# EAGLE board 56 ch sample-and-hold card v1.2 (EAGLE 9.6.2)
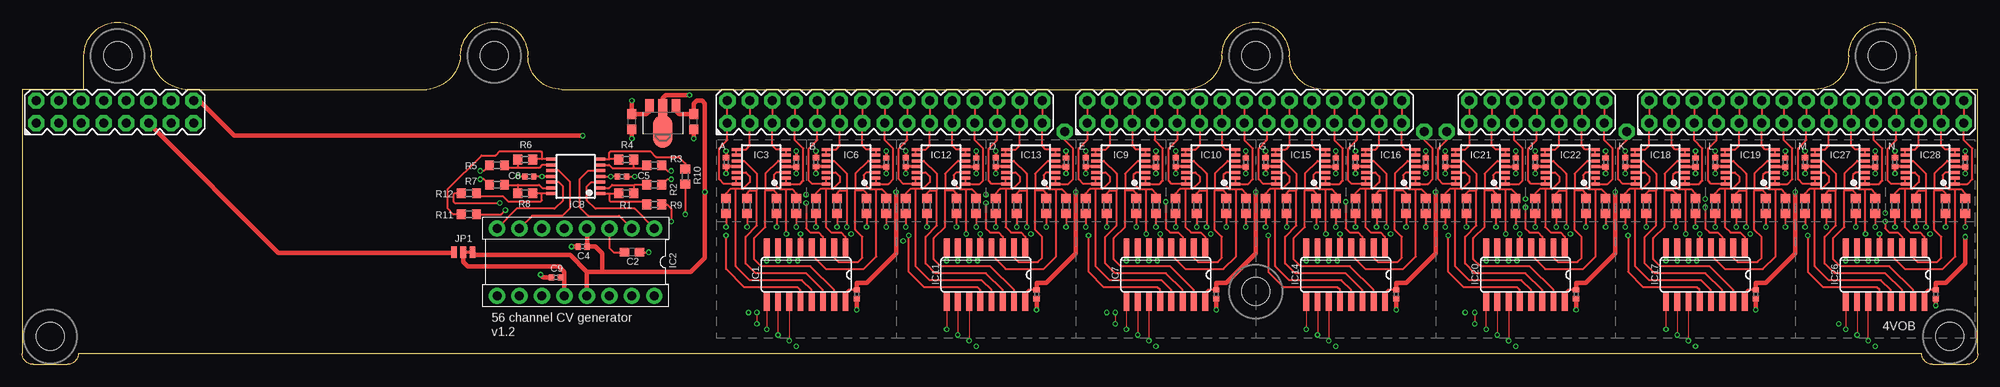
[diagram p3: board, top side]
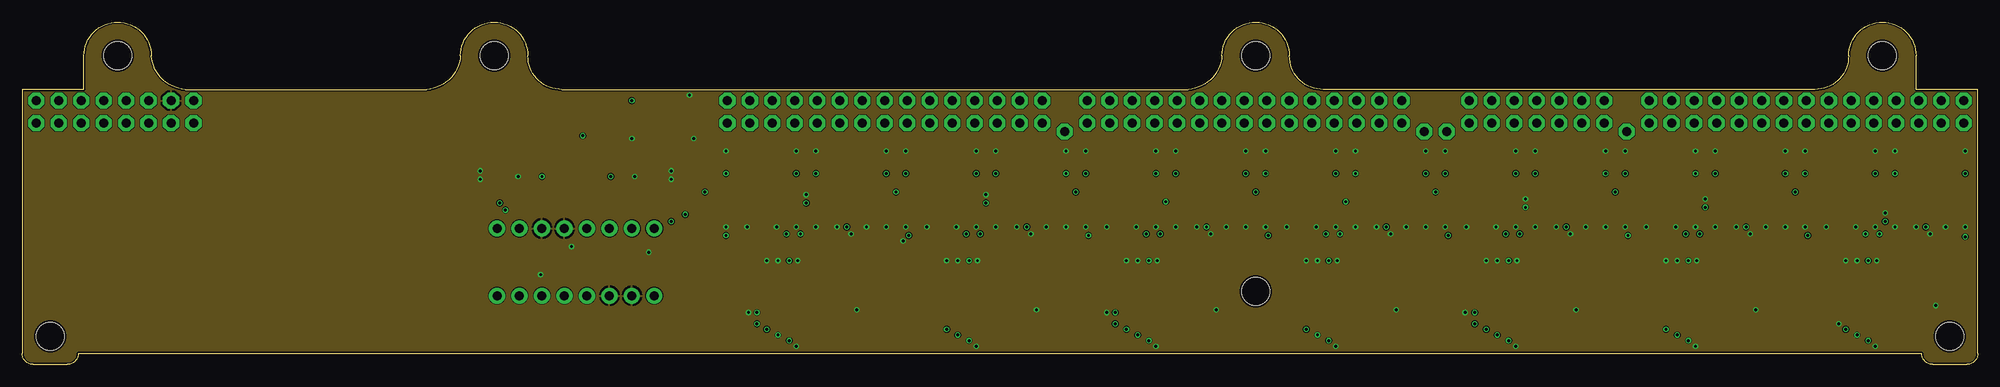
[diagram p4: board, inner layer Route2]
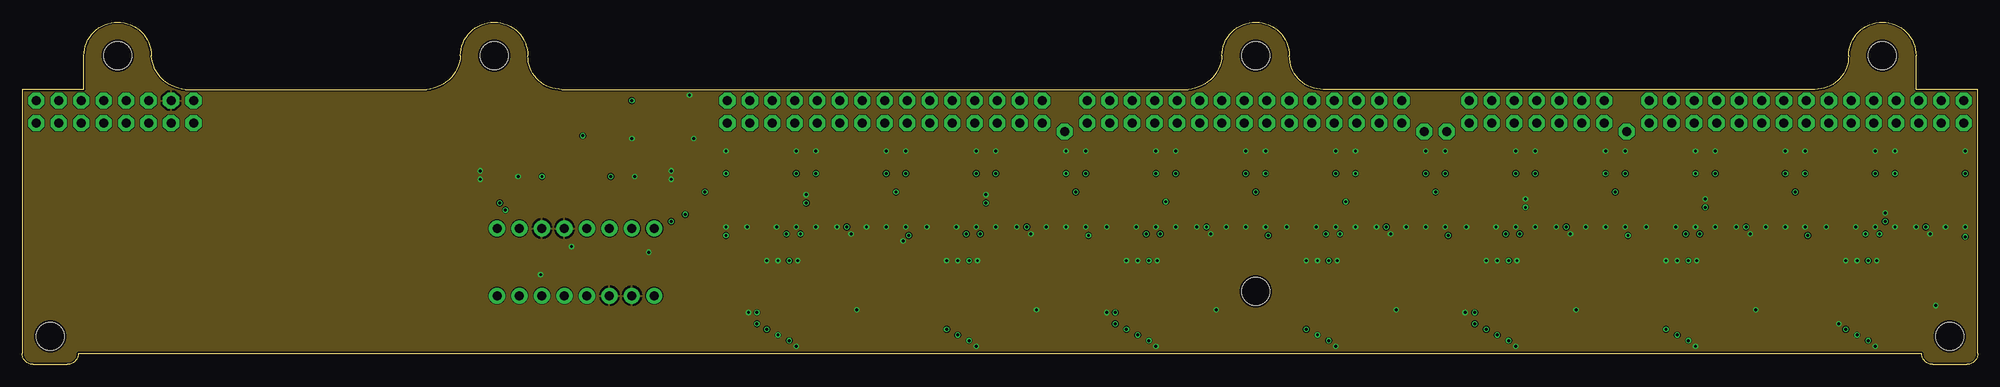
[diagram p5: board, inner layer Route15]
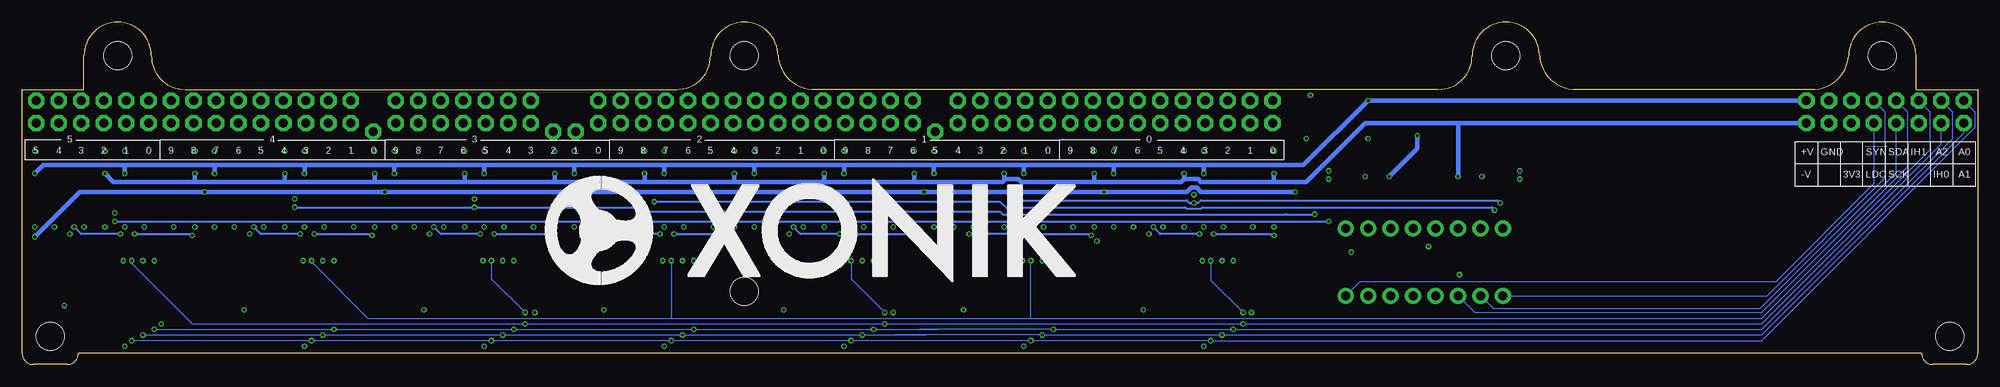
[diagram p6: board, bottom side, seen from below]

Size 220.98 x 38.74 mm. Coordinates in mm from the lower left corner, seen from the top.
Outline: 1.27,0 5.08,0 arc90 6.35,1.27 214.63,1.27 arc90 215.9,0 219.71,0 arc90 220.98,1.27 220.98,31.11 214,31.11 214,34.93 arc180 206.38,34.93 arc-90 202.56,31.11 147,31.11 arc-90 143.19,34.93 arc180 135.57,34.93 arc-81 131.76,31.11 60.96,31.11 arc-90 57.15,34.93 arc180 49.53,34.93 arc-81 45.72,31.11 18.41,31.11 arc-81 14.61,34.93 arc180 6.99,34.93 6.99,31.11 0,31.11 0,1.27 arc90 1.27,0
Copper layers (1+2*15+16): Top 0.035mm / dielectric 0.2mm / Route2 0.0175mm / dielectric 1.065mm / Route15 0.0175mm / dielectric 0.2mm / Bottom 0.035mm
Design rules "jlcpcb-4layers": minimum track width 3.5mil, minimum drill 0.2mm, track to track 3.5mil, track to pad 5mil, pad to pad 5mil, via to via 5mil, smd to smd 5mil, copper to edge 0.2mm, drill to drill 6mil, minimum pad ring 10mil, minimum via ring 0.13mm, stop-mask expansion 0.05mm, vias tented up to drill 16mil, thermal gap 10mil
Holes 3.2 mm at 3.17,3.17 217.81,3.17 139.38,8.26 139.38,34.93 210.19,34.93 10.79,34.93 53.34,34.93

## Footprints (pad centres in the part's own frame; a part is rotated, then mirrored left to right if it is on the bottom)
C0603 = smd 1.1 x 1: 1 -0.85,0; 2 0.85,0
C0402-J = smd 0.6 x 0.7: 1 -0.5,0; 2 0.5,0
C0603-J = smd 1 x 1.1: 1 -0.85,0; 2 0.85,0
SO16 = smd 0.66 x 2.032: 1 -4.445,-3.073; 2 -3.175,-3.073; 3 -1.905,-3.073; 4 -0.635,-3.073; 5 0.635,-3.073; 6 1.905,-3.073; 7 3.175,-3.073; 8 4.445,-3.073; 9 4.445,3.073; 10 3.175,3.073; 11 1.905,3.073; 12 0.635,3.073; 13 -0.635,3.073; 14 -1.905,3.073; 15 -3.175,3.073; 16 -4.445,3.073
DIL16-FM-CON = drill 1.016: 1 -8.89,-3.81; 2 -6.35,-3.81; 3 -3.81,-3.81; 4 -1.27,-3.81; 5 1.27,-3.81; 6 3.81,-3.81; 7 6.35,-3.81; 8 8.89,-3.81; 9 8.89,3.81; 10 6.35,3.81; 11 3.81,3.81; 12 1.27,3.81; 13 -1.27,3.81; 14 -3.81,3.81; 15 -6.35,3.81; 16 -8.89,3.81
TSSOP14J = smd 0.35 x 1: 1 -1.95,-2.825; 2 -1.3,-2.825; 3 -0.65,-2.825; 4 0,-2.825; 5 0.65,-2.825; 6 1.3,-2.825; 7 1.95,-2.825; 8 1.95,2.825; 9 1.3,2.825; 10 0.65,2.825; 11 0,2.825; 12 -0.65,2.825; 13 -1.3,2.825; 14 -1.95,2.825
SOT89 = smd 1 x 1.5: 1 -1.499,-1.981; 3 1.499,-1.981 | smd 1 x 2: 2 0,-1.727 | smd 2.2 x 3.7: 2@1 0,0.94
SMT-JUMPER_3_1-NC_TRACE_NO-SILK = smd 0.66 x 1.27: 1 -1.041,0; 2 0,0; 3 1.041,0
R0603 = smd 1 x 1.1: 1 -0.85,0; 2 0.85,0
MA15-2J = drill 1.016 octagon: 1 -17.78,-1.27; 2 -17.78,1.27; 3 -15.24,-1.27; 4 -15.24,1.27; 5 -12.7,-1.27; 6 -12.7,1.27; 7 -10.16,-1.27; 8 -10.16,1.27; 9 -7.62,-1.27; 10 -7.62,1.27; 11 -5.08,-1.27; 12 -5.08,1.27; 13 -2.54,-1.27; 14 -2.54,1.27; 15 0,-1.27; 16 0,1.27; 17 2.54,-1.27; 18 2.54,1.27; 19 5.08,-1.27; 20 5.08,1.27; 21 7.62,-1.27; 22 7.62,1.27; 23 10.16,-1.27; 24 10.16,1.27; 25 12.7,-1.27; 26 12.7,1.27; 27 15.24,-1.27; 28 15.24,1.27; 29 17.78,-1.27; 30 17.78,1.27
MA01N-1J = drill 1.016 octagon: 1 0,0
MA08-2J = drill 1.016 octagon: 1 -8.89,-1.27; 2 -8.89,1.27; 3 -6.35,-1.27; 4 -6.35,1.27; 5 -3.81,-1.27; 6 -3.81,1.27; 7 -1.27,-1.27; 8 -1.27,1.27; 9 1.27,-1.27; 10 1.27,1.27; 11 3.81,-1.27; 12 3.81,1.27; 13 6.35,-1.27; 14 6.35,1.27; 15 8.89,-1.27; 16 8.89,1.27
MA02N-1J = drill 1.016 octagon: 1 -2.54,0; 2 0,0
MA07-2J = drill 1.016 octagon: 1 -7.62,-1.27; 2 -7.62,1.27; 3 -5.08,-1.27; 4 -5.08,1.27; 5 -2.54,-1.27; 6 -2.54,1.27; 7 0,-1.27; 8 0,1.27; 9 2.54,-1.27; 10 2.54,1.27; 11 5.08,-1.27; 12 5.08,1.27; 13 7.62,-1.27; 14 7.62,1.27

## Placement (x,y rotation side)
C1  0.1uF  [C0603]  75.88,27.46 90 top
C2  100nF  [C0603]  68.9,12.7 180 top
C3  0.33uF  [C0603]  68.9,27.46 90 top
C4  1uF  [C0402-J]  63.34,13.33 180 top
C5  1uF  [C0402-J]  67.79,21.27 0 top
C6  0.1uF  [C0402-J]  94.3,7.94 90 top
C7  1nF  [C0603-J]  87.47,17.94 90 top
C8  1uF  [C0402-J]  57.31,21.27 0 top
C9  1uF  [C0402-J]  60.33,9.84 180 top
C11  1nF  [C0603-J]  85.25,17.94 90 top
C12  1nF  [C0603-J]  81.92,17.94 90 top
C13  1nF  [C0603-J]  79.53,17.94 90 top
C14  1uF  [C0402-J]  87.47,22.86 90 top
C15  1uF  [C0402-J]  79.53,22.88 270 top
C16  1nF  [C0603-J]  97.63,17.94 90 top
C17  1nF  [C0603-J]  95.41,17.94 90 top
C18  1nF  [C0603-J]  92.08,17.94 90 top
C25  1nF  [C0603-J]  89.69,17.94 90 top
C26  1uF  [C0402-J]  97.63,22.86 90 top
C27  1uF  [C0402-J]  89.69,22.88 270 top
C28  0.1uF  [C0402-J]  134.94,7.94 90 top
C29  1nF  [C0603-J]  128.11,17.94 90 top
C30  1nF  [C0603-J]  125.89,17.94 90 top
C31  1nF  [C0603-J]  122.56,17.94 90 top
C32  1nF  [C0603-J]  120.17,17.94 90 top
C33  1uF  [C0402-J]  128.11,22.86 90 top
C34  1uF  [C0402-J]  120.17,22.88 270 top
C35  1nF  [C0603-J]  138.27,17.94 90 top
C36  1nF  [C0603-J]  136.05,17.94 90 top
C37  1nF  [C0603-J]  132.72,17.94 90 top
C38  1nF  [C0603-J]  130.33,17.94 90 top
C39  1uF  [C0402-J]  138.27,22.86 90 top
C41  1uF  [C0402-J]  130.33,22.88 270 top
C42  0.1uF  [C0402-J]  114.62,7.94 90 top
C43  1nF  [C0603-J]  107.79,17.94 90 top
C44  1nF  [C0603-J]  105.57,17.94 90 top
C45  1nF  [C0603-J]  102.23,17.94 90 top
C46  1nF  [C0603-J]  99.85,17.94 90 top
C47  1uF  [C0402-J]  107.79,22.86 90 top
C48  1uF  [C0402-J]  99.85,22.88 270 top
C49  1nF  [C0603-J]  117.95,17.94 90 top
C50  1nF  [C0603-J]  115.73,17.94 90 top
C51  1nF  [C0603-J]  112.39,17.94 90 top
C52  1nF  [C0603-J]  110.01,17.94 90 top
C53  1uF  [C0402-J]  117.95,22.86 90 top
C54  1uF  [C0402-J]  110.01,22.88 270 top
C55  0.1uF  [C0402-J]  155.26,7.94 90 top
C56  1nF  [C0603-J]  148.43,17.94 90 top
C57  1nF  [C0603-J]  146.21,17.94 90 top
C58  1nF  [C0603-J]  142.88,17.94 90 top
C59  1nF  [C0603-J]  140.49,17.94 90 top
C60  1uF  [C0402-J]  148.43,22.86 90 top
C61  1uF  [C0402-J]  140.49,22.88 270 top
C62  1nF  [C0603-J]  158.59,17.94 90 top
C63  1nF  [C0603-J]  156.37,17.94 90 top
C64  1nF  [C0603-J]  153.03,17.94 90 top
C65  1nF  [C0603-J]  150.65,17.94 90 top
C66  1uF  [C0402-J]  158.59,22.86 90 top
C67  1uF  [C0402-J]  150.65,22.88 270 top
C68  0.1uF  [C0402-J]  195.9,7.94 90 top
C69  1nF  [C0603-J]  189.07,17.94 90 top
C70  1nF  [C0603-J]  186.85,17.94 90 top
C71  1nF  [C0603-J]  183.51,17.94 90 top
C72  1nF  [C0603-J]  181.13,17.94 90 top
C73  1uF  [C0402-J]  189.07,22.86 90 top
C74  1uF  [C0402-J]  181.13,22.88 270 top
C75  1nF  [C0603-J]  199.23,17.94 90 top
C76  1nF  [C0603-J]  197.01,17.94 90 top
C77  1nF  [C0603-J]  193.68,17.94 90 top
C78  1nF  [C0603-J]  191.29,17.94 90 top
C79  1uF  [C0402-J]  199.23,22.86 90 top
C80  1uF  [C0402-J]  191.29,22.88 270 top
C81  0.1uF  [C0402-J]  175.58,7.94 90 top
C82  1nF  [C0603-J]  168.75,17.94 90 top
C83  1nF  [C0603-J]  166.53,17.94 90 top
C84  1nF  [C0603-J]  163.19,17.94 90 top
C85  1nF  [C0603-J]  160.81,17.94 90 top
C86  1uF  [C0402-J]  168.75,22.86 90 top
C87  1uF  [C0402-J]  160.81,22.88 270 top
C88  1nF  [C0603-J]  178.91,17.94 90 top
C89  1nF  [C0603-J]  176.69,17.94 90 top
C90  1nF  [C0603-J]  173.35,17.94 90 top
C91  1nF  [C0603-J]  170.97,17.94 90 top
C92  1uF  [C0402-J]  178.91,22.86 90 top
C93  1uF  [C0402-J]  170.97,22.88 270 top
C107  0.1uF  [C0402-J]  216.22,7.94 90 top
C108  1nF  [C0603-J]  209.39,17.94 90 top
C109  1nF  [C0603-J]  207.17,17.94 90 top
C110  1nF  [C0603-J]  203.84,17.94 90 top
C111  1nF  [C0603-J]  201.45,17.94 90 top
C112  1uF  [C0402-J]  209.39,22.86 90 top
C113  1uF  [C0402-J]  201.45,22.88 270 top
C114  1nF  [C0603-J]  219.55,17.94 90 top
C115  1nF  [C0603-J]  217.33,17.94 90 top
C116  1nF  [C0603-J]  214,17.94 90 top
C117  1nF  [C0603-J]  211.61,17.94 90 top
C118  1uF  [C0402-J]  219.55,22.86 90 top
C119  1uF  [C0402-J]  211.61,22.88 270 top
IC1  74HCT4051D  [SO16]  88.58,10.16 180 top
IC2  DAC8565F  [DIL16-FM-CON]  62.55,11.59 180 top
IC3  TL074JT  [TSSOP14J]  83.5,22.38 90 top
IC5  78L05F  [SOT89]  72.39,27.3 180 top
IC6  TL074JT  [TSSOP14J]  93.66,22.38 90 top
IC7  74HCT4051D  [SO16]  129.22,10.16 180 top
IC8  TL074JT  [TSSOP14J]  62.55,21.27 90 top
IC9  TL074JT  [TSSOP14J]  124.14,22.38 90 top
IC10  TL074JT  [TSSOP14J]  134.3,22.38 90 top
IC11  74HCT4051D  [SO16]  108.9,10.16 180 top
IC12  TL074JT  [TSSOP14J]  103.82,22.38 90 top
IC13  TL074JT  [TSSOP14J]  113.98,22.38 90 top
IC14  74HCT4051D  [SO16]  149.54,10.16 180 top
IC15  TL074JT  [TSSOP14J]  144.46,22.38 90 top
IC16  TL074JT  [TSSOP14J]  154.62,22.38 90 top
IC17  74HCT4051D  [SO16]  190.18,10.16 180 top
IC18  TL074JT  [TSSOP14J]  185.1,22.38 90 top
IC19  TL074JT  [TSSOP14J]  195.26,22.38 90 top
IC20  74HCT4051D  [SO16]  169.86,10.16 180 top
IC21  TL074JT  [TSSOP14J]  164.78,22.38 90 top
IC22  TL074JT  [TSSOP14J]  174.94,22.38 90 top
IC26  74HCT4051D  [SO16]  210.5,10.16 180 top
IC27  TL074JT  [TSSOP14J]  205.42,22.38 90 top
IC28  TL074JT  [TSSOP14J]  215.58,22.38 90 top
JP1  JUMPER-SMT_3_1-NC_TRACE_NO-SILK_DNM  [SMT-JUMPER_3_1-NC_TRACE_NO-SILK]  49.85,12.7 0 top
R1  10k  [R0603]  68.26,19.37 180 top
R2  10k  [R0603]  71.44,20.32 180 top
R3  10k  [R0603]  71.44,22.54 180 top
R4  10k  [R0603]  68.26,23.18 180 top
R5  10k  [R0603]  53.66,22.54 0 top
R6  10k  [R0603]  56.83,23.18 0 top
R7  10k  [R0603]  53.66,20.32 0 top
R8  10k  [R0603]  56.83,19.37 0 top
R9  220R  [R0603]  71.44,18.1 0 top
R10  220R  [R0603]  74.93,21.27 270 top
R11  220R  [R0603]  50.48,16.99 0 top
R12  220R  [R0603]  50.48,19.37 180 top
U$1  [XONIK_LOGO_60]  161.93,9.05 0 bottom
U$2  MA15-2J-FEMALE  [MA15-2J]  97.47,28.57 0 top
U$3  MA15-2J-FEMALE  [MA15-2J]  138.11,28.57 0 top
U$4  MA15-2J-FEMALE  [MA15-2J]  201.61,28.57 0 top
X4  DNM  [MA01N-1J]  181.29,26.35 0 top
X5  DNM  [MA01N-1J]  117.79,26.35 0 top
X6  MA08-2J-FEMALE  [MA08-2J]  10.48,28.57 0 top
X9  DNM  [MA02N-1J]  160.97,26.35 0 top
X10  MA07-2J-FEMALE  [MA07-2J]  171.13,28.57 0 top

## Tracks (layer width: path | path; a pad name or v marks a point on that pad's centre or on a via)
5V_REF
  Top 0.254: IC2.3 66.36,13.18 66.83,12.7 C2.2
!SYNC
  Bottom 0.127: 10.56,21.03 10.48,21.11 10.48,24.13
  Bottom 0.13: IC2.9 23.81,7.78 10.56,21.03 | 10.48,24.13 10.48,28.57 X6.10
+3V3
  Top 0.508: JP1.1 48.72,12.61 28.96,12.61 14.29,27.29 X6.11
+5V  (via drill 0.33)
  Top 0.254: C6.2 94.27,8.41 93.34,8.41 93.03,8.1 IC1.16 | C42.2 114.59,8.41 113.67,8.41 113.35,8.1 IC11.16 | C28.2 134.91,8.41 133.99,8.41 133.67,8.1 IC7.16 | C55.2 155.23,8.41 154.31,8.41 153.99,8.1 IC14.16 | C81.2 175.55,8.41 174.62,8.41 174.31,8.1 IC20.16 | C68.2 195.87,8.41 194.94,8.41 194.63,8.1 IC17.16 | C107.2 216.19,8.41 215.26,8.41 214.95,8.1 IC26.16
  Top 0.508: C6.2 94.3,9.21 95.41,9.21 98.74,12.54 v98.74,19.53 | C42.2 114.62,9.21 115.73,9.21 119.06,12.54 v119.06,19.53 | C28.2 134.94,9.21 136.05,9.21 139.38,12.54 v139.38,19.53 | C55.2 155.26,9.21 156.37,9.21 159.7,12.54 v159.7,19.53 | C81.2 175.58,9.21 176.69,9.21 180.02,12.54 v180.02,19.53 | C68.2 195.9,9.21 197.01,9.21 200.34,12.54 v200.34,19.53 | C107.2 216.22,9.21 217.33,9.21 219.55,11.43 v219.55,14.45 | IC5.1 73.89,28.66 74.24,28.31 C1.2 75.88,29.53 76.2,29.84 76.83,29.84 77.15,29.53 v77.15,19.53 77.15,12.06 75.56,10.48 65.56,10.48 | IC2.4 63.84,15.38 C4.1 64.77,13.33 65.56,12.54 65.56,10.48 | 65.56,10.48 63.82,10.48 | 63.82,10.48 61.91,12.38 51.21,12.38 JP1.3 | IC2.13 63.82,10.48
  Bottom 0.508: v219.55,14.45 214.47,19.53 v200.34,19.53 v180.02,19.53 v159.7,19.53 v139.38,19.53 v119.06,19.53 109.7,19.53 109.22,20 108.58,20 108.11,19.53 v98.74,19.53 89.38,19.53 88.9,20 88.27,20 87.79,19.53 v77.15,19.53
+12V  (via drill 0.33)
  Top 0.254: C5.1 v66.52,21.27 IC8.4
  Top 0.356: IC3.4 87.45,22.38 C14.1 v87.47,21.59 | IC6.4 97.61,22.38 C26.1 v97.63,21.59 | IC12.4 107.77,22.38 C47.1 v107.79,21.59 | IC13.4 117.93,22.38 C53.1 v117.95,21.59 | IC9.4 128.09,22.38 C33.1 v128.11,21.59 | IC10.4 138.25,22.38 C39.1 v138.27,21.59 | IC15.4 148.41,22.38 C60.1 v148.43,21.59 | IC16.4 158.57,22.38 C66.1 v158.59,21.59 | IC21.4 168.73,22.38 C86.1 v168.75,21.59 | IC22.4 178.89,22.38 C92.1 v178.91,21.59 | IC18.4 189.05,22.38 C73.1 v189.07,21.59 | IC19.4 199.21,22.38 C79.1 v199.23,21.59 | IC27.4 209.37,22.38 C112.1 v209.39,21.59 | IC28.4 219.53,22.38 C118.1 v219.55,21.59
  Top 0.508: IC5.3 70.89,28.66 70.54,28.31 C3.2 v68.9,29.84 | X6.16 20,29.84 23.97,25.88 v63.34,25.88
  Bottom 0.508: 97.63,21.75 v97.63,21.59 97.63,22.54 | 87.47,21.75 v87.47,21.59 87.47,22.54 | 117.95,21.75 v117.95,21.59 117.95,22.38 118.11,22.54 | 107.79,21.75 v107.79,21.59 107.79,22.54 | 138.27,21.75 v138.27,21.59 138.27,22.54 | 128.11,21.75 v128.11,21.59 128.11,22.38 128.27,22.54 | 158.59,21.75 v158.59,21.59 158.59,22.54 | 148.43,21.75 v148.43,21.59 148.43,22.54 | 178.91,21.75 v178.91,21.59 178.91,22.54 | 168.75,21.75 v168.75,21.59 168.75,22.54 | 199.23,21.75 v199.23,21.59 199.23,22.54 | 189.07,21.75 v189.07,21.59 189.07,22.38 189.23,22.54 | 209.39,21.75 v209.39,21.59 209.39,22.54 | X6.16 v68.9,29.84 76.2,22.54 87.47,22.54 | v219.55,21.59 218.6,22.54 209.39,22.54 | 97.63,22.54 107.79,22.54 | 107.79,22.54 118.11,22.54 | 118.11,22.54 128.27,22.54 | 128.27,22.54 138.27,22.54 | 138.27,22.54 148.43,22.54 | 148.43,22.54 158.59,22.54 | 158.59,22.54 168.75,22.54 | 168.75,22.54 178.91,22.54 | 178.91,22.54 189.23,22.54 | 189.23,22.54 199.23,22.54 | 199.23,22.54 209.39,22.54 | 97.63,22.54 87.47,22.54 | v63.34,25.88 63.34,24.45 v66.52,21.27
-12V  (via drill 0.33)
  Top 0.254: C8.2 v58.74,21.27 IC8.11
  Top 0.356: IC3.11 C15.2 v79.53,21.59 | IC6.11 C27.2 v89.69,21.59 | IC12.11 C48.2 v99.85,21.59 | IC13.11 C54.2 v110.01,21.59 | IC9.11 C34.2 v120.17,21.59 | IC10.11 C41.2 v130.33,21.59 | IC15.11 C61.2 v140.49,21.59 | IC16.11 C67.2 v150.65,21.59 | IC21.11 C87.2 v160.81,21.59 | IC22.11 C93.2 v170.97,21.59 | IC18.11 C74.2 v181.13,21.59 | IC19.11 C80.2 v191.29,21.59 | IC27.11 C113.2 v201.45,21.59 | IC28.11 C119.2 v211.61,21.59
  Bottom 0.508: v79.53,21.59 79.53,20.64 | v89.69,21.59 89.69,20.95 | 79.53,20.64 75.88,20.64 69.22,27.3 X6.15 58.74,27.3 v58.74,21.27 | v99.85,21.59 99.85,20.64 | v110.01,21.59 110.01,20.95 | 110.01,20.95 110.01,20.8 110.17,20.64 120.17,20.64 | 99.85,20.64 90.01,20.64 89.69,20.95 | v120.17,21.59 120.17,20.64 | v130.33,21.59 130.33,20.64 | v140.49,21.59 140.49,20.64 | v150.65,21.59 150.65,20.64 | 130.33,20.64 140.49,20.64 | v160.81,21.59 160.81,20.64 | v170.97,21.59 170.97,20.64 | 150.65,20.64 160.81,20.64 | v181.13,21.59 181.13,20.64 | v191.29,21.59 191.29,20.64 | 170.97,20.64 181.13,20.64 | v201.45,21.59 201.45,20.64 | v211.61,21.59 210.66,20.64 201.45,20.64 | 191.29,20.64 201.45,20.64 | 181.13,20.64 191.29,20.64 | 160.81,20.64 170.97,20.64 | 140.49,20.64 150.65,20.64 | 120.17,20.64 130.33,20.64 | 99.85,20.64 108.11,20.64 108.43,20.95 110.01,20.95 | 79.53,20.64 87.79,20.64 88.11,20.95 89.69,20.95
A0  (via drill 0.33)
  Top 0.13: IC1.11 v86.68,2.7 | v208.6,2.7 IC26.11 | IC17.11 v188.28,2.7 | IC14.11 v147.64,2.7 | IC7.11 v127.32,2.7 | IC11.11 v107,2.7 | IC20.11 v167.96,2.7
  Bottom 0.127: 0.4,26.75 0.32,26.83 0.32,28.57 X6.2 | 118.9,2.7 121.13,2.7
  Bottom 0.13: 118.9,2.7 v107,2.7 v86.68,2.7 24.45,2.7 0.4,26.75 | 121.13,2.7 v127.32,2.7 v147.64,2.7 v167.96,2.7 v188.28,2.7 v208.6,2.7
A1  (via drill 0.33)
  Top 0.13: IC26.10 v207.33,3.33 | v85.41,3.33 IC1.10 | IC17.10 v187.01,3.33 | IC14.10 v146.37,3.33 | IC7.10 v126.05,3.33 | IC11.10 v105.73,3.33 | IC20.10 v166.69,3.33
  Bottom 0.127: 118.59,3.33 122.4,3.33
  Bottom 0.13: v207.33,3.33 v187.01,3.33 v166.69,3.33 v146.37,3.33 v126.05,3.33 122.4,3.33 118.9,3.33 | 118.59,3.33 v105.73,3.33 v85.41,3.33 24.45,3.33 1.59,26.19 X6.1
A2  (via drill 0.33)
  Top 0.13: IC1.9 v84.14,3.97 | IC26.9 v206.06,3.97 | IC17.9 v185.74,3.97 | IC14.9 v145.1,3.97 | IC7.9 v124.78,3.97 | IC11.9 v104.46,3.97 | v165.42,3.97 IC20.9
  Bottom 0.127: v124.78,3.97 119.54,3.97 116.68,3.97
  Bottom 0.13: v206.06,3.97 v185.74,3.97 v165.42,3.97 v145.1,3.97 119.54,3.97 117.47,3.97 | 116.68,3.97 v104.46,3.97 v84.14,3.97 24.45,3.97 2.86,25.56 2.86,28.57 X6.4
AGND  (via drill 0.33)
  Top 0.254: C13.1 v79.53,15.56 | C12.1 v81.92,15.56 | C11.1 v85.25,15.56 | C7.1 v87.47,15.56 | C25.1 v89.69,15.56 | C18.1 v92.08,15.56 | C17.1 v95.41,15.56 | C16.1 v97.63,15.56 | IC1.8 v84.14,11.75 | IC1.7 v85.41,11.75 | C46.1 v99.85,15.56 | C45.1 v102.23,15.56 | C44.1 v105.57,15.56 | C43.1 v107.79,15.56 | C52.1 v110.01,15.56 | C51.1 v112.39,15.56 | C50.1 v115.73,15.56 | C49.1 v117.95,15.56 | IC11.8 v104.46,11.75 | IC11.7 v105.73,11.75 | C32.1 v120.17,15.56 | C31.1 v122.56,15.56 | C30.1 v125.89,15.56 | C29.1 v128.11,15.56 | C38.1 v130.33,15.56 | C37.1 v132.72,15.56 | C36.1 v136.05,15.56 | C35.1 v138.27,15.56 | IC7.8 v124.78,11.75 | IC7.7 v126.05,11.75 | C59.1 v140.49,15.56 | C58.1 v142.88,15.56 | C57.1 v146.21,15.56 | C56.1 v148.43,15.56 | C65.1 v150.65,15.56 | C64.1 v153.03,15.56 | C63.1 v156.37,15.56 | C62.1 v158.59,15.56 | IC14.8 v145.1,11.75 | IC14.7 v146.37,11.75 | C85.1 v160.81,15.56 | C84.1 v163.19,15.56 | C83.1 v166.53,15.56 | C82.1 v168.75,15.56 | C91.1 v170.97,15.56 | C90.1 v173.35,15.56 | C89.1 v176.69,15.56 | C88.1 v178.91,15.56 | IC20.8 v165.42,11.75 | IC20.7 v166.69,11.75 | C72.1 v181.13,15.56 | C71.1 v183.51,15.56 | C70.1 v186.85,15.56 | C69.1 v189.07,15.56 | C78.1 v191.29,15.56 | C77.1 v193.68,15.56 | C76.1 v197.01,15.56 | C75.1 v199.23,15.56 | IC17.8 v185.74,11.75 | IC17.7 v187.01,11.75 | C111.1 v201.45,15.56 | C110.1 v203.84,15.56 | C109.1 v207.17,15.56 | C108.1 v209.39,15.56 | C117.1 v211.61,15.56 | C116.1 v214,15.56 | C115.1 v217.33,15.56 | C114.1 v219.55,15.56 | IC26.8 v206.06,11.75 | IC26.7 v207.33,11.75 | C2.1 v70.8,12.7 | R5.1 52.17,21.91 v51.75,21.91 | R7.1 52.17,20.95 v51.75,20.95 | R3.1 72.92,21.91 v73.34,21.91 | R2.1 72.92,20.95 v73.34,20.95 | C5.2 v69.22,21.27 | C8.1 v56.04,21.27 | IC5.2 IC5.2@1
  Top 0.356: v79.53,24.13 C15.1 | v87.47,24.13 C14.2 | v89.69,24.13 C27.1 | v97.63,24.13 C26.2 | v99.85,24.13 C48.1 | v107.79,24.13 C47.2 | v110.01,24.13 C54.1 | v117.95,24.13 C53.2 | v120.17,24.13 C34.1 | v128.11,24.13 C33.2 | v130.33,24.13 C41.1 | v138.27,24.13 C39.2 | v140.49,24.13 C61.1 | v148.43,24.13 C60.2 | v150.65,24.13 C67.1 | v158.59,24.13 C66.2 | v160.81,24.13 C87.1 | v168.75,24.13 C86.2 | v170.97,24.13 C93.1 | v178.91,24.13 C92.2 | v181.13,24.13 C74.1 | v189.07,24.13 C73.2 | v191.29,24.13 C80.1 | v199.23,24.13 C79.2 | v201.45,24.13 C113.1 | v209.39,24.13 C112.2 | v211.61,24.13 C119.1 | v219.55,24.13 C118.2
  Top 0.508: C6.1 v94.3,6.19 | C42.1 v114.62,6.19 | C28.1 v134.94,6.19 | C55.1 v155.26,6.19 | C81.1 v175.58,6.19 | C68.1 v195.9,6.19 | C107.1 v216.22,6.67 | C3.1 v68.9,25.56 | C1.1 v75.88,25.56 | IC5.2 72.39,30.14 72.73,30.48 v75.41,30.48 | C4.2 v62.07,13.33 | C9.2 58.9,9.84 v58.58,10.16
  other vias: 82.07,5.87 87.47,2.06 107.79,2.06 128.11,2.06 148.43,2.06 168.75,2.06 189.07,2.06 209.39,2.06 169.86,18.73 190.18,18.73 210.5,17.14 108.9,19.21 88.58,19.21 93.66,14.76 113.98,14.76 134.3,14.76 154.62,14.76 174.94,14.76 195.26,14.76 215.58,14.76 99.54,13.97 87.63,11.75 107.95,11.75 128.27,11.75 148.59,11.75 168.91,11.75 189.23,11.75 209.55,11.75 122.56,5.87 163.04,5.87 205.26,4.6
  pour Route2: -1.11,41.28 222.25,41.28 222.25,0 -1.11,0
  pour Route15: -1.91,42.55 223.52,42.55 223.52,-0.64 -1.91,-0.64
DAC_1  (via drill 0.33)
  Top 0.254: v210.5,16.19 210.5,15.4 210.98,14.92 211.93,14.92 212.41,14.45 IC26.3 | R9.2 72.87,18.1 73.34,17.62 v73.34,16.19
  Bottom 0.254: v210.5,16.19 v73.34,16.19
DAC_2  (via drill 0.33)
  Top 0.254: v169.86,17.78 169.86,15.4 170.34,14.92 171.29,14.92 171.77,14.45 IC20.3 | v190.18,17.78 190.18,15.4 190.66,14.92 191.61,14.92 192.09,14.45 IC17.3 | R10.2 74.93,17.04 74.96,17.01 v74.93,16.99
  Bottom 0.254: v190.18,17.78 v169.86,17.78 150.65,17.78 150.18,17.3 110.49,17.3 110.17,16.99 78.26,16.99 78.11,16.99 v74.93,16.99
DAC_3  (via drill 0.33)
  Top 0.254: v129.22,18.41 129.22,15.4 129.7,14.92 130.65,14.92 131.13,14.45 IC7.3 | v149.54,18.41 149.54,15.4 150.02,14.92 150.97,14.92 151.45,14.45 IC14.3 | R11.2 54.13,16.99 v54.61,17.46
  Bottom 0.254: v149.54,18.41 v129.22,18.41 110.49,18.41 109.7,17.62 108.11,17.62 107.95,17.78 89.53,17.78 89.38,17.62 87.79,17.62 87.63,17.78 54.93,17.78 v54.61,17.46
DAC_4  (via drill 0.33)
  Top 0.254: v88.58,18.26 88.58,15.4 89.06,14.92 90.01,14.92 90.49,14.45 IC1.3 | v108.9,18.26 108.9,15.4 109.38,14.92 110.33,14.92 110.81,14.45 IC11.3 | R12.2 48.9,19.37 48.74,19.21 48.74,18.41 48.9,18.26 v53.98,18.26
  Bottom 0.254: v108.9,18.26 108.43,18.26 108.11,18.57 89.38,18.57 89.06,18.26 v88.58,18.26 88.11,18.26 87.79,18.57 54.29,18.57 v53.98,18.26
DAC_BUF_1
  Top 0.254: IC8.1 66.36,19.32 | 66.36,19.32 67.37,19.32 R1.2 | 66.36,19.32 66.36,18.57 66.52,18.41 70.27,18.41 R9.1
DAC_BUF_2
  Top 0.254: IC8.7 66.36,23.22 | 66.36,23.22 67.37,23.22 R4.2 | 66.36,23.22 66.36,23.97 66.52,24.13 70.96,24.13 71.6,23.5 74.19,23.5 74.93,22.76 R10.1
DAC_BUF_3
  Top 0.254: IC8.8 58.74,23.22 | 58.74,23.22 57.73,23.22 R6.2 | 58.74,23.22 58.74,23.97 58.58,24.13 53.98,24.13 53.5,23.65 51.91,23.65 48.1,19.84 48.1,17.62 48.74,16.99 R11.1
DAC_BUF_4
  Top 0.254: IC8.14 58.74,19.32 | 58.74,19.32 57.73,19.32 R8.2 | R12.1 51.65,19.05 54.29,19.05 54.93,18.41 58.58,18.41 58.74,18.57 58.74,19.32
DAC_RAW_1
  Top 0.254: IC8.3 64.28,20.62 63.82,20.16 63.82,18.57 64.77,17.62 69.22,17.62 IC2.1
DAC_RAW_2
  Top 0.254: IC8.5 63.99,21.92 63.02,20.95 63.02,17.78 63.98,16.83 67.47,16.83 IC2.2
DAC_RAW_3
  Top 0.254: IC8.10 60.63,21.92 61.91,20.64 61.91,17.72 61.02,16.83 57.63,16.83 IC2.7
DAC_RAW_4
  Top 0.254: IC8.12 59.74,20.64 60.64,20.64 61.12,20.16 61.12,18.57 60.17,17.62 55.88,17.62 IC2.8
IN_0
  Top 0.254: IC3.12 81.77,21.73 82.23,21.27 82.23,20.64 81.44,19.84 80.64,19.84 | C13.2 79.53,19.37 80.01,19.84 80.64,19.84 | IC1.13 89.22,8.41 88.11,9.53 82.23,9.53 80.64,11.11 80.64,19.84
IN_1
  Top 0.254: IC3.10 81.58,23.03 83.03,21.59 83.03,19.68 | 83.03,19.68 83.03,15.72 81.76,14.45 81.76,11.43 82.87,10.32 88.58,10.32 90.49,8.41 IC1.14 | C12.2 81.92,19.37 82.23,19.68 83.03,19.68
IN_2
  Top 0.254: IC3.5 85.42,23.03 83.98,21.59 83.98,19.84 83.98,19.74 83.98,19.68 | 83.98,19.68 83.98,15.56 82.71,14.29 82.71,11.91 83.5,11.11 89.06,11.11 91.76,8.41 IC1.15 | C11.2 85.25,19.37 84.93,19.68 83.98,19.68
IN_3  (via drill 0.33)
  Top 0.254: C7.2 87.47,19.37 87,19.84 86.36,19.84 | IC3.3 85.23,21.73 84.93,21.43 84.93,20.48 85.57,19.84 86.36,19.84 | v86.36,14.76 86.36,19.84 | IC1.12 87.95,8.41 87.63,8.73 81.6,8.73 79.53,10.79 v79.53,14.61
  Bottom 0.254: v86.36,14.76 79.69,14.76 v79.53,14.61
IN_4
  Top 0.254: IC6.12 91.93,21.73 92.39,21.27 92.39,20.64 91.6,19.84 90.81,19.84 | C25.2 89.69,19.37 90.17,19.84 90.81,19.84 | 90.81,19.84 90.81,15.56 91.44,14.92 92.55,14.92 93.03,14.45 IC1.1
IN_5  (via drill 0.33)
  Top 0.254: IC6.10 91.74,23.03 93.19,21.59 93.19,19.68 | C18.2 92.08,19.37 92.39,19.68 93.19,19.68 | v87.95,14.76 IC1.5 | 93.19,19.68 v93.19,15.56
  Bottom 0.254: v93.19,15.56 92.39,14.76 v87.95,14.76
IN_6
  Top 0.254: IC6.5 95.58,23.03 94.14,21.59 94.14,19.84 94.14,19.74 94.14,19.68 | 94.14,19.68 94.14,15.24 94.93,14.45 94.93,12.06 94.46,11.59 92.23,11.59 91.76,12.06 IC1.2 | C17.2 95.41,19.37 95.09,19.68 94.14,19.68
IN_7
  Top 0.254: C16.2 97.63,19.37 97.16,19.84 96.52,19.84 | IC6.3 95.39,21.73 95.09,21.43 95.09,20.48 95.73,19.84 96.52,19.84 | IC1.4 89.22,12.38 90.81,10.79 95.09,10.79 96.52,12.22 96.52,19.84
IN_8
  Top 0.254: IC12.12 102.09,21.73 102.55,21.27 102.55,20.64 101.76,19.84 100.97,19.84 | C46.2 99.85,19.37 100.33,19.84 100.97,19.84 | IC11.13 109.54,8.41 108.43,9.53 102.55,9.53 100.97,11.11 100.97,19.84
IN_9
  Top 0.254: IC12.10 101.9,23.03 103.35,21.59 103.35,19.68 | 103.35,19.68 103.35,15.72 102.08,14.45 102.08,11.43 103.19,10.32 108.9,10.32 110.81,8.41 IC11.14 | C45.2 102.23,19.37 102.55,19.68 103.35,19.68
IN_10
  Top 0.254: IC12.5 105.74,23.03 104.3,21.59 104.3,19.84 104.3,19.74 104.3,19.68 | 104.3,19.68 104.3,15.56 103.03,14.29 103.03,11.91 103.82,11.11 109.38,11.11 112.08,8.41 IC11.15 | C44.2 105.57,19.37 105.25,19.68 104.3,19.68
IN_11  (via drill 0.33)
  Top 0.254: C43.2 107.79,19.37 107.31,19.84 106.68,19.84 | IC12.3 105.55,21.73 105.25,21.43 105.25,20.48 105.89,19.84 106.68,19.84 | v106.68,14.76 106.68,19.84 | IC11.12 108.27,8.41 107.95,8.73 101.92,8.73 100.17,10.48 v100.17,14.61
  Bottom 0.254: v106.68,14.76 100.33,14.76 v100.17,14.61
IN_12
  Top 0.254: IC13.12 112.25,21.73 112.71,21.27 112.71,20.64 111.92,19.84 111.12,19.84 | C52.2 110.01,19.37 110.49,19.84 111.12,19.84 | 111.12,19.84 111.12,15.56 111.76,14.92 112.87,14.92 113.35,14.45 IC11.1
IN_13  (via drill 0.33)
  Top 0.254: IC13.10 112.06,23.03 113.51,21.59 113.51,19.68 | C51.2 112.39,19.37 112.71,19.68 113.51,19.68 | v108.27,14.76 IC11.5 | 113.51,19.68 v113.51,15.56
  Bottom 0.254: v113.51,15.56 112.71,14.76 v108.27,14.76
IN_14
  Top 0.254: IC13.5 115.9,23.03 114.46,21.59 114.46,19.84 114.46,19.74 114.46,19.68 | 114.46,19.68 114.46,15.24 115.25,14.45 115.25,12.06 114.78,11.59 112.55,11.59 112.08,12.06 IC11.2 | C50.2 115.73,19.37 115.41,19.68 114.46,19.68
IN_15
  Top 0.254: C49.2 117.95,19.37 117.47,19.84 116.84,19.84 | IC13.3 115.71,21.73 115.41,21.43 115.41,20.48 116.05,19.84 116.84,19.84 | IC11.4 109.54,12.38 111.12,10.79 115.41,10.79 116.84,12.22 116.84,19.84
IN_16
  Top 0.254: IC9.12 122.41,21.73 122.87,21.27 122.87,20.64 122.08,19.84 121.28,19.84 | C32.2 120.17,19.37 120.65,19.84 121.28,19.84 | IC7.13 129.86,8.41 128.75,9.53 122.87,9.53 121.28,11.11 121.28,19.84
IN_17
  Top 0.254: IC9.10 122.22,23.03 123.67,21.59 123.67,19.68 | 123.67,19.68 123.67,15.72 122.4,14.45 122.4,11.43 123.51,10.32 129.22,10.32 131.13,8.41 IC7.14 | C31.2 122.56,19.37 122.87,19.68 123.67,19.68
IN_18
  Top 0.254: IC9.5 126.06,23.03 124.62,21.59 124.62,19.84 124.62,19.74 124.62,19.68 | 124.62,19.68 124.62,15.56 123.35,14.29 123.35,11.91 124.14,11.11 129.7,11.11 132.4,8.41 IC7.15 | C30.2 125.89,19.37 125.57,19.68 124.62,19.68
IN_19  (via drill 0.33)
  Top 0.254: C29.2 128.11,19.37 127.64,19.84 127,19.84 | IC9.3 125.87,21.73 125.57,21.43 125.57,20.48 126.21,19.84 127,19.84 | v127,14.76 127,19.84 | IC7.12 128.59,8.41 128.27,8.73 122.24,8.73 120.49,10.48 v120.49,14.61
  Bottom 0.254: v127,14.76 120.65,14.76 v120.49,14.61
IN_20
  Top 0.254: IC10.12 132.57,21.73 133.03,21.27 133.03,20.64 132.24,19.84 131.44,19.84 | C38.2 130.33,19.37 130.81,19.84 131.44,19.84 | 131.44,19.84 131.44,15.56 132.08,14.92 133.19,14.92 133.67,14.45 IC7.1
IN_21  (via drill 0.33)
  Top 0.254: IC10.10 132.38,23.03 133.83,21.59 133.83,19.68 | C37.2 132.72,19.37 133.03,19.68 133.83,19.68 | v128.59,14.76 IC7.5 | 133.83,19.68 v133.83,15.56
  Bottom 0.254: v128.59,14.76 133.03,14.76 v133.83,15.56
IN_22
  Top 0.254: IC10.5 136.22,23.03 134.78,21.59 134.78,19.84 134.78,19.74 134.78,19.68 | 134.78,19.68 134.78,15.24 135.57,14.45 135.57,12.06 135.1,11.59 132.87,11.59 132.4,12.06 IC7.2 | C36.2 136.05,19.37 135.73,19.68 134.78,19.68
IN_23
  Top 0.254: C35.2 138.27,19.37 137.79,19.84 137.16,19.84 | IC10.3 136.03,21.73 135.73,21.43 135.73,20.48 136.37,19.84 137.16,19.84 | IC7.4 129.86,12.38 131.44,10.79 135.73,10.79 137.16,12.22 137.16,19.84
IN_24
  Top 0.254: IC15.12 142.73,21.73 143.19,21.27 143.19,20.64 142.4,19.84 141.6,19.84 | C59.2 140.49,19.37 140.97,19.84 141.6,19.84 | IC14.13 150.18,8.41 149.07,9.53 143.19,9.53 141.6,11.11 141.6,19.84
IN_25
  Top 0.254: IC15.10 142.54,23.03 143.99,21.59 143.99,19.68 | 143.99,19.68 143.99,15.72 142.72,14.45 142.72,11.43 143.83,10.32 149.54,10.32 151.45,8.41 IC14.14 | C58.2 142.88,19.37 143.19,19.68 143.99,19.68
IN_26
  Top 0.254: IC15.5 146.38,23.03 144.94,21.59 144.94,19.84 144.94,19.74 144.94,19.68 | 144.94,19.68 144.94,15.56 143.67,14.29 143.67,11.91 144.46,11.11 150.02,11.11 152.72,8.41 IC14.15 | C57.2 146.21,19.37 145.89,19.68 144.94,19.68
IN_27  (via drill 0.33)
  Top 0.254: C56.2 148.43,19.37 147.96,19.84 147.32,19.84 | IC15.3 146.19,21.73 145.89,21.43 145.89,20.48 146.53,19.84 147.32,19.84 | v147.32,14.76 147.32,19.84 | IC14.12 148.91,8.41 148.59,8.73 142.56,8.73 140.81,10.48 v140.81,14.61
  Bottom 0.254: v147.32,14.76 140.97,14.76 v140.81,14.61
IN_28
  Top 0.254: IC16.12 152.89,21.73 153.35,21.27 153.35,20.64 152.56,19.84 151.76,19.84 | C65.2 150.65,19.37 151.13,19.84 151.76,19.84 | 151.76,19.84 151.76,15.56 152.4,14.92 153.51,14.92 153.99,14.45 IC14.1
IN_29  (via drill 0.33)
  Top 0.254: IC16.10 152.7,23.03 154.15,21.59 154.15,19.68 | C64.2 153.03,19.37 153.35,19.68 154.15,19.68 | v148.91,14.76 IC14.5 | 154.15,19.68 v154.15,15.56
  Bottom 0.254: v154.15,15.56 153.35,14.76 v148.91,14.76
IN_30
  Top 0.254: IC16.5 156.54,23.03 155.1,21.59 155.1,19.84 155.1,19.74 155.1,19.68 | 155.1,19.68 155.1,15.24 155.89,14.45 155.89,12.06 155.42,11.59 153.19,11.59 152.72,12.06 IC14.2 | C63.2 156.37,19.37 156.05,19.68 155.1,19.68
IN_31
  Top 0.254: C62.2 158.59,19.37 158.12,19.84 157.48,19.84 | IC16.3 156.35,21.73 156.05,21.43 156.05,20.48 156.69,19.84 157.48,19.84 | IC14.4 150.18,12.38 151.76,10.79 156.05,10.79 157.48,12.22 157.48,19.84
IN_32
  Top 0.254: IC21.12 163.05,21.73 163.51,21.27 163.51,20.64 162.72,19.84 161.93,19.84 | C85.2 160.81,19.37 161.29,19.84 161.93,19.84 | IC20.13 170.5,8.41 169.39,9.53 163.51,9.53 161.93,11.11 161.93,19.84
IN_33
  Top 0.254: IC21.10 162.86,23.03 164.31,21.59 164.31,19.68 | 164.31,19.68 164.31,15.72 163.04,14.45 163.04,11.43 164.15,10.32 169.86,10.32 171.77,8.41 IC20.14 | C84.2 163.19,19.37 163.51,19.68 164.31,19.68
IN_34
  Top 0.254: IC21.5 166.7,23.03 165.26,21.59 165.26,19.84 165.26,19.74 165.26,19.68 | 165.26,19.68 165.26,15.56 163.99,14.29 163.99,11.91 164.78,11.11 170.34,11.11 173.04,8.41 IC20.15 | C83.2 166.53,19.37 166.21,19.68 165.26,19.68
IN_35  (via drill 0.33)
  Top 0.254: C82.2 168.75,19.37 168.28,19.84 167.64,19.84 | IC21.3 166.51,21.73 166.21,21.43 166.21,20.48 166.85,19.84 167.64,19.84 | v167.64,14.76 167.64,19.84 | IC20.12 169.23,8.41 168.91,8.73 162.88,8.73 161.13,10.48 v161.13,14.61
  Bottom 0.254: v167.64,14.76 161.29,14.76 v161.13,14.61
IN_36
  Top 0.254: IC22.12 173.21,21.73 173.67,21.27 173.67,20.64 172.88,19.84 172.09,19.84 | C91.2 170.97,19.37 171.45,19.84 172.09,19.84 | 172.09,19.84 172.09,15.56 172.72,14.92 173.83,14.92 174.31,14.45 IC20.1
IN_37  (via drill 0.33)
  Top 0.254: IC22.10 173.02,23.03 174.47,21.59 174.47,19.68 | C90.2 173.35,19.37 173.67,19.68 174.47,19.68 | v169.23,14.76 IC20.5 | 174.47,19.68 v174.47,15.56
  Bottom 0.254: v169.23,14.76 173.67,14.76 v174.47,15.56
IN_38
  Top 0.254: IC22.5 176.86,23.03 175.42,21.59 175.42,19.84 175.42,19.74 175.42,19.68 | 175.42,19.68 175.42,15.24 176.21,14.45 176.21,12.06 175.74,11.59 173.51,11.59 173.04,12.06 IC20.2 | C89.2 176.69,19.37 176.37,19.68 175.42,19.68
IN_39
  Top 0.254: C88.2 178.91,19.37 178.44,19.84 177.8,19.84 | IC22.3 176.67,21.73 176.37,21.43 176.37,20.48 177.01,19.84 177.8,19.84 | IC20.4 170.5,12.38 172.09,10.79 176.37,10.79 177.8,12.22 177.8,19.84
IN_40
  Top 0.254: IC18.12 183.37,21.73 183.83,21.27 183.83,20.64 183.04,19.84 182.25,19.84 | C72.2 181.13,19.37 181.61,19.84 182.25,19.84 | IC17.13 190.82,8.41 189.71,9.53 183.83,9.53 182.25,11.11 182.25,19.84
IN_41
  Top 0.254: IC18.10 183.18,23.03 184.63,21.59 184.63,19.68 | 184.63,19.68 184.63,15.72 183.36,14.45 183.36,11.43 184.47,10.32 190.18,10.32 192.09,8.41 IC17.14 | C71.2 183.51,19.37 183.83,19.68 184.63,19.68
IN_42
  Top 0.254: IC18.5 187.02,23.03 185.58,21.59 185.58,19.84 185.58,19.74 185.58,19.68 | 185.58,19.68 185.58,15.56 184.31,14.29 184.31,11.91 185.1,11.11 190.66,11.11 193.36,8.41 IC17.15 | C70.2 186.85,19.37 186.53,19.68 185.58,19.68
IN_43  (via drill 0.33)
  Top 0.254: C69.2 189.07,19.37 188.59,19.84 187.96,19.84 | IC18.3 186.83,21.73 186.53,21.43 186.53,20.48 187.17,19.84 187.96,19.84 | v187.96,14.76 187.96,19.84 | IC17.12 189.55,8.41 189.23,8.73 183.2,8.73 181.45,10.48 v181.45,14.61
  Bottom 0.254: v187.96,14.76 181.61,14.76 v181.45,14.61
IN_44
  Top 0.254: IC19.12 193.53,21.73 193.99,21.27 193.99,20.64 193.2,19.84 192.41,19.84 | C78.2 191.29,19.37 191.77,19.84 192.41,19.84 | 192.41,19.84 192.41,15.56 193.04,14.92 194.15,14.92 194.63,14.45 IC17.1
IN_45  (via drill 0.33)
  Top 0.254: IC19.10 193.34,23.03 194.79,21.59 194.79,19.68 | C77.2 193.68,19.37 193.99,19.68 194.79,19.68 | v189.55,14.76 IC17.5 | 194.79,19.68 v194.79,15.56
  Bottom 0.254: v189.55,14.76 193.99,14.76 v194.79,15.56
IN_46
  Top 0.254: IC19.5 197.18,23.03 195.74,21.59 195.74,19.84 195.74,19.74 195.74,19.68 | 195.74,19.68 195.74,15.24 196.53,14.45 196.53,12.06 196.06,11.59 193.83,11.59 193.36,12.06 IC17.2 | C76.2 197.01,19.37 196.69,19.68 195.74,19.68
IN_47
  Top 0.254: C75.2 199.23,19.37 198.75,19.84 198.12,19.84 | IC19.3 196.99,21.73 196.69,21.43 196.69,20.48 197.33,19.84 198.12,19.84 | IC17.4 190.82,12.38 192.41,10.79 196.69,10.79 198.12,12.22 198.12,19.84
IN_48
  Top 0.254: IC27.12 203.69,21.73 204.15,21.27 204.15,20.64 203.36,19.84 202.56,19.84 | C111.2 201.45,19.37 201.93,19.84 202.56,19.84 | IC26.13 211.14,8.41 210.03,9.53 204.15,9.53 202.56,11.11 202.56,19.84
IN_49
  Top 0.254: IC27.10 203.5,23.03 204.95,21.59 204.95,19.68 | 204.95,19.68 204.95,15.72 203.68,14.45 203.68,11.43 204.79,10.32 210.5,10.32 212.41,8.41 IC26.14 | C110.2 203.84,19.37 204.15,19.68 204.95,19.68
IN_50
  Top 0.254: IC27.5 207.34,23.03 205.9,21.59 205.9,19.84 205.9,19.74 205.9,19.68 | 205.9,19.68 205.9,15.56 204.63,14.29 204.63,11.91 205.42,11.11 210.98,11.11 213.68,8.41 IC26.15 | C109.2 207.17,19.37 206.85,19.68 205.9,19.68
IN_51  (via drill 0.33)
  Top 0.254: C108.2 209.39,19.37 208.91,19.84 208.28,19.84 | IC27.3 207.15,21.73 206.85,21.43 206.85,20.48 207.49,19.84 208.28,19.84 | v208.28,14.76 208.28,19.84 | IC26.12 209.87,8.41 209.55,8.73 203.52,8.73 201.77,10.48 v201.77,14.61
  Bottom 0.254: v208.28,14.76 201.93,14.76 v201.77,14.61
IN_52
  Top 0.254: IC28.12 213.85,21.73 214.31,21.27 214.31,20.64 213.52,19.84 212.72,19.84 | C117.2 211.61,19.37 212.09,19.84 212.72,19.84 | 212.72,19.84 212.72,15.56 213.36,14.92 214.47,14.92 214.95,14.45 IC26.1
IN_53  (via drill 0.33)
  Top 0.254: IC28.10 213.66,23.03 215.11,21.59 215.11,19.68 | C116.2 214,19.37 214.31,19.68 215.11,19.68 | v209.87,14.76 IC26.5 | 215.11,19.68 v215.11,15.56
  Bottom 0.254: v209.87,14.76 214.31,14.76 v215.11,15.56
IN_54
  Top 0.254: IC28.5 217.5,23.03 216.06,21.59 216.06,19.84 216.06,19.74 216.06,19.68 | 216.06,19.68 216.06,15.24 216.85,14.45 216.85,12.06 216.38,11.59 214.15,11.59 213.68,12.06 IC26.2 | C115.2 217.33,19.37 217.01,19.68 216.06,19.68
IN_55
  Top 0.254: C114.2 219.55,19.37 219.07,19.84 218.44,19.84 | IC28.3 217.31,21.73 217.01,21.43 217.01,20.48 217.65,19.84 218.44,19.84 | IC26.4 211.14,12.38 212.72,10.79 217.01,10.79 218.44,12.22 218.44,19.84
INH_0  (via drill 0.33)
  Top 0.13: IC1.6 v86.68,11.75 | IC7.6 v127.32,11.75 | IC20.6 v167.96,11.75 | IC26.6 v208.6,11.75 | v83.03,5.87 v83.03,4.6 | v123.51,5.87 v123.51,4.6 | v164.15,5.87 v164.15,4.6
  Bottom 0.127: 4.13,24.92 X6.3 | v164.15,4.6 158.75,4.6
  Bottom 0.13: v86.68,11.75 86.68,9.53 v83.03,5.87 | v127.32,11.75 127.32,9.68 v123.51,5.87 | v167.96,11.75 167.96,9.68 v164.15,5.87 | v208.6,11.75 208.6,11.43 201.77,4.6 158.75,4.6 157,4.6 v123.51,4.6 v83.03,4.6 24.45,4.6 4.13,24.92 | 4.13,27.15 X6.3
INH_1  (via drill 0.33)
  Top 0.13: IC11.6 v107,11.75 | IC14.6 v147.64,11.75 | IC17.6 v188.28,11.75
  Bottom 0.127: 5.48,24.21 5.4,24.29 5.4,28.57
  Bottom 0.13: v188.28,11.75 188.28,11.59 181.93,5.24 147.64,5.24 | 147.64,5.24 107,5.24 | 107,5.24 24.45,5.24 5.48,24.21 | 107,5.24 v107,11.75 | v147.64,11.75 147.64,5.24 | 5.4,28.57 X6.6
LDAC
  Bottom 0.127: 11.75,20.48 22.86,9.37 69.85,9.37 IC2.16
  Bottom 0.13: X6.9 11.75,20.48
N$1
  Top 0.508: JP1.2 49.85,11.59 50.32,11.11 60.64,11.11 61.28,10.48 61.28,9.84 | 61.28,9.84 IC2.12 | C9.1 61.28,9.84
N$2
  Top 0.254: IC8.2 66.33,19.97 66.67,20.32 69.22,20.32 | R2.2 69.22,20.32 | 69.22,20.32 69.11,20.22 R1.1
N$3
  Top 0.254: IC8.6 66.33,22.57 66.67,22.22 69.06,22.22 | R3.2 70.27,22.22 69.06,22.22 | 69.06,22.22 69.11,22.28 R4.1
N$4
  Top 0.254: IC8.9 59.69,22.54 58.74,22.54 58.42,22.22 56.04,22.22 | 56.04,22.22 54.83,22.22 R5.2 | R6.1 55.98,22.28 56.04,22.22
N$5
  Top 0.254: R7.2 56.04,20.32 | 56.04,20.32 58.42,20.32 58.77,19.97 IC8.13 | 56.04,20.32 55.98,20.26 R8.1
OUT_0
  Top 0.254: IC3.14 IC3.13 | IC3.14 80.68,21.07 80.72,21.11 | IC3.14 79.26,20.43 78.74,20.95 78.74,24.45 79.69,25.4 U$2.1 U$2.2
OUT_1
  Top 0.254: IC3.9 IC3.8 81.8,24.33 82.23,24.77 U$2.3 U$2.4
OUT_2
  Top 0.254: IC3.6 IC3.7 85.2,24.33 84.77,24.77 U$2.5 U$2.6
OUT_3
  Top 0.254: IC3.1 IC3.2 | IC3.1 86.33,21.07 86.28,21.11 | IC3.1 87.9,20.43 88.27,20.8 88.27,24.45 87.31,25.4 U$2.7 U$2.8
OUT_4
  Top 0.254: IC6.14 IC6.13 | IC6.14 90.84,21.07 90.88,21.11 | IC6.14 89.26,20.43 88.9,20.8 88.9,24.45 89.85,25.4 U$2.9 U$2.10
OUT_5
  Top 0.254: IC6.9 IC6.8 91.96,24.33 92.39,24.77 U$2.11 U$2.12
OUT_6
  Top 0.254: IC6.6 IC6.7 95.36,24.33 94.93,24.77 U$2.13 U$2.14
OUT_7
  Top 0.254: IC6.1 IC6.2 | IC6.1 96.49,21.07 96.44,21.11 | IC6.1 97.9,20.43 98.42,20.95 98.42,24.45 97.47,25.4 U$2.15 U$2.16
OUT_8
  Top 0.254: IC12.14 IC12.13 | IC12.14 101,21.07 101.04,21.11 | IC12.14 99.58,20.43 99.06,20.95 99.06,24.45 100.01,25.4 U$2.17 U$2.18
OUT_9
  Top 0.254: IC12.9 IC12.8 102.12,24.33 102.55,24.77 U$2.19 U$2.20
OUT_10
  Top 0.254: IC12.6 IC12.7 105.52,24.33 105.09,24.77 U$2.21 U$2.22
OUT_11
  Top 0.254: IC12.1 IC12.2 | IC12.1 106.65,21.07 106.6,21.11 | IC12.1 108.22,20.43 108.58,20.8 108.58,24.45 107.63,25.4 U$2.23 U$2.24
OUT_12
  Top 0.254: IC13.14 IC13.13 | IC13.14 111.16,21.07 111.2,21.11 | IC13.14 109.58,20.43 109.22,20.8 109.22,24.45 110.17,25.4 U$2.25 U$2.26
OUT_13
  Top 0.254: IC13.9 IC13.8 112.28,24.33 112.71,24.77 U$2.27 U$2.28
OUT_14
  Top 0.254: IC13.6 IC13.7 115.68,24.33 115.25,24.77 U$2.29 U$2.30
OUT_15
  Top 0.254: IC13.1 IC13.2 | IC13.1 116.81,21.07 116.76,21.11 | IC13.1 118.22,20.43 118.75,20.95 118.75,24.45 117.79,25.4 X5.1
OUT_16
  Top 0.254: IC9.14 IC9.13 | IC9.14 121.32,21.07 121.36,21.11 | IC9.14 119.9,20.43 119.38,20.95 119.38,24.45 120.33,25.4 U$3.1 U$3.2
OUT_17
  Top 0.254: IC9.9 IC9.8 122.44,24.33 122.87,24.77 U$3.3 U$3.4
OUT_18
  Top 0.254: IC9.6 IC9.7 125.84,24.33 125.41,24.77 U$3.5 U$3.6
OUT_19
  Top 0.254: IC9.1 IC9.2 | IC9.1 126.97,21.07 126.92,21.11 | IC9.1 128.54,20.43 128.91,20.8 128.91,24.45 127.95,25.4 U$3.7 U$3.8
OUT_20
  Top 0.254: IC10.14 IC10.13 | IC10.14 131.48,21.07 131.52,21.11 | IC10.14 129.9,20.43 129.54,20.8 129.54,24.45 130.49,25.4 U$3.9 U$3.10
OUT_21
  Top 0.254: IC10.9 IC10.8 132.6,24.33 133.03,24.77 U$3.11 U$3.12
OUT_22
  Top 0.254: IC10.6 IC10.7 136,24.33 135.57,24.77 U$3.13 U$3.14
OUT_23
  Top 0.254: IC10.1 IC10.2 | IC10.1 137.13,21.07 137.08,21.11 | IC10.1 138.54,20.43 139.06,20.95 139.06,24.45 138.11,25.4 U$3.15 U$3.16
OUT_24
  Top 0.254: IC15.14 IC15.13 | IC15.14 141.64,21.07 141.68,21.11 | IC15.14 140.22,20.43 139.7,20.95 139.7,24.45 140.65,25.4 U$3.17 U$3.18
OUT_25
  Top 0.254: IC15.9 IC15.8 142.76,24.33 143.19,24.77 U$3.19 U$3.20
OUT_26
  Top 0.254: IC15.6 IC15.7 146.16,24.33 145.73,24.77 U$3.21 U$3.22
OUT_27
  Top 0.254: IC15.1 IC15.2 | IC15.1 147.29,21.07 147.24,21.11 | IC15.1 148.86,20.43 149.22,20.8 149.22,24.45 148.27,25.4 U$3.23 U$3.24
OUT_28
  Top 0.254: IC16.14 IC16.13 | IC16.14 151.8,21.07 151.84,21.11 | IC16.14 150.22,20.43 149.86,20.8 149.86,24.45 150.81,25.4 U$3.25 U$3.26
OUT_29
  Top 0.254: IC16.9 IC16.8 152.92,24.33 153.35,24.77 U$3.27 U$3.28
OUT_30
  Top 0.254: IC16.6 IC16.7 156.32,24.33 155.89,24.77 U$3.29 U$3.30
OUT_31
  Top 0.254: IC16.1 IC16.2 | IC16.1 157.45,21.07 157.4,21.11 | IC16.1 158.86,20.43 159.38,20.95 159.38,24.45 158.43,25.4 X9.1
OUT_32
  Top 0.254: IC21.14 IC21.13 | IC21.14 161.96,21.07 162,21.11 | IC21.14 160.54,20.43 160.02,20.95 160.02,24.45 160.97,25.4 X9.2
OUT_33
  Top 0.254: IC21.9 IC21.8 163.08,24.33 163.51,24.77 X10.1 X10.2
OUT_34
  Top 0.254: IC21.6 IC21.7 166.48,24.33 166.05,24.77 X10.3 X10.4
OUT_35
  Top 0.254: IC21.1 IC21.2 | IC21.1 167.61,21.07 167.56,21.11 | IC21.1 169.18,20.43 169.54,20.8 169.54,24.45 168.59,25.4 X10.5 X10.6
OUT_36
  Top 0.254: IC22.14 IC22.13 | IC22.14 172.12,21.07 172.16,21.11 | IC22.14 170.54,20.43 170.18,20.8 170.18,24.45 171.13,25.4 X10.7 X10.8
OUT_37
  Top 0.254: IC22.9 IC22.8 173.24,24.33 173.67,24.77 X10.9 X10.10
OUT_38
  Top 0.254: IC22.6 IC22.7 176.64,24.33 176.21,24.77 X10.11 X10.12
OUT_39
  Top 0.254: IC22.1 IC22.2 | IC22.1 177.77,21.07 177.72,21.11 | IC22.1 179.18,20.43 179.71,20.95 179.71,24.45 178.75,25.4 X10.13 X10.14
OUT_40
  Top 0.254: IC18.14 IC18.13 | IC18.14 182.28,21.07 182.32,21.11 | IC18.14 180.86,20.43 180.34,20.95 180.34,24.45 181.29,25.4 X4.1
OUT_41
  Top 0.254: IC18.9 IC18.8 183.4,24.33 183.83,24.77 U$4.1 U$4.2
OUT_42
  Top 0.254: IC18.6 IC18.7 186.8,24.33 186.37,24.77 U$4.3 U$4.4
OUT_43
  Top 0.254: IC18.1 IC18.2 | IC18.1 187.93,21.07 187.88,21.11 | IC18.1 189.5,20.43 189.87,20.8 189.87,24.45 188.91,25.4 U$4.5 U$4.6
OUT_44
  Top 0.254: IC19.14 IC19.13 | IC19.14 192.44,21.07 192.48,21.11 | IC19.14 190.86,20.43 190.5,20.8 190.5,24.45 191.45,25.4 U$4.7 U$4.8
OUT_45
  Top 0.254: IC19.9 IC19.8 193.56,24.33 193.99,24.77 U$4.9 U$4.10
OUT_46
  Top 0.254: IC19.6 IC19.7 196.96,24.33 196.53,24.77 U$4.11 U$4.12
OUT_47
  Top 0.254: IC19.1 IC19.2 | IC19.1 198.09,21.07 198.04,21.11 | IC19.1 199.5,20.43 200.03,20.95 200.03,24.45 199.07,25.4 U$4.13 U$4.14
OUT_48
  Top 0.254: IC27.14 IC27.13 | IC27.14 202.6,21.07 202.64,21.11 | IC27.14 201.18,20.43 200.66,20.95 200.66,24.45 201.61,25.4 U$4.15 U$4.16
OUT_49
  Top 0.254: IC27.9 IC27.8 203.72,24.33 204.15,24.77 U$4.17 U$4.18
OUT_50
  Top 0.254: IC27.6 IC27.7 207.12,24.33 206.69,24.77 U$4.19 U$4.20
OUT_51
  Top 0.254: IC27.1 IC27.2 | IC27.1 208.25,21.07 208.2,21.11 | IC27.1 209.82,20.43 210.19,20.8 210.19,24.45 209.23,25.4 U$4.21 U$4.22
OUT_52
  Top 0.254: IC28.14 IC28.13 | IC28.14 212.76,21.07 212.8,21.11 | IC28.14 211.18,20.43 210.82,20.8 210.82,24.45 211.77,25.4 U$4.23 U$4.24
OUT_53
  Top 0.254: IC28.9 IC28.8 213.88,24.33 214.31,24.77 U$4.25 U$4.26
OUT_54
  Top 0.254: IC28.6 IC28.7 217.28,24.33 216.85,24.77 U$4.27 U$4.28
OUT_55
  Top 0.254: IC28.1 IC28.2 | IC28.1 218.41,21.07 218.36,21.11 | IC28.1 219.82,20.43 220.34,20.95 220.34,24.45 219.39,25.4 U$4.29 U$4.30
SCK
  Bottom 0.127: 9.29,21.67 9.21,21.75 X6.7
  Bottom 0.13: IC2.10 54.77,6.35 24.61,6.35 9.29,21.67
SDA
  Bottom 0.127: 7.94,22.38 7.94,23.02
  Bottom 0.13: IC2.11 56.83,5.87 24.45,5.87 7.94,22.38 | 7.94,23.02 7.94,28.57 X6.8

## Text on the board
tNames: A | B | C | D | E | F | G | H | I | J | K | L | M | N | 56 channel CV generator | 4VOB | v1.2
bNames: 0 | 1 | 2 | 3 | 4 | 5 | 0 | 1 | 2 | 3 | 4 | 5 | 6 | 7 | 8 | 9 | 0 | 1 | 2 | 3 | 4 | 5 | 6 | 7 | 8 | 9 | 0 | 1 | 2 | 3 | 4 | 5 | 6 | 7 | 8 | 9 | 0 | 1 | 2 | 3 | 4 | 5 | 6 | 7 | 8 | 9 | 0 | 1 | 2 | 3 | 4 | 5 | 6 | 7 | 8 | 9 | 0 | 1 | 2 | 3 | 4 | 5 | A0 | A2 | IH1 | SDA | !SYN | GND | +V | A1 | IH0 | SCK | LDC | 3V3 | -V